# Altium project AHD Shield Template.PrjPcb
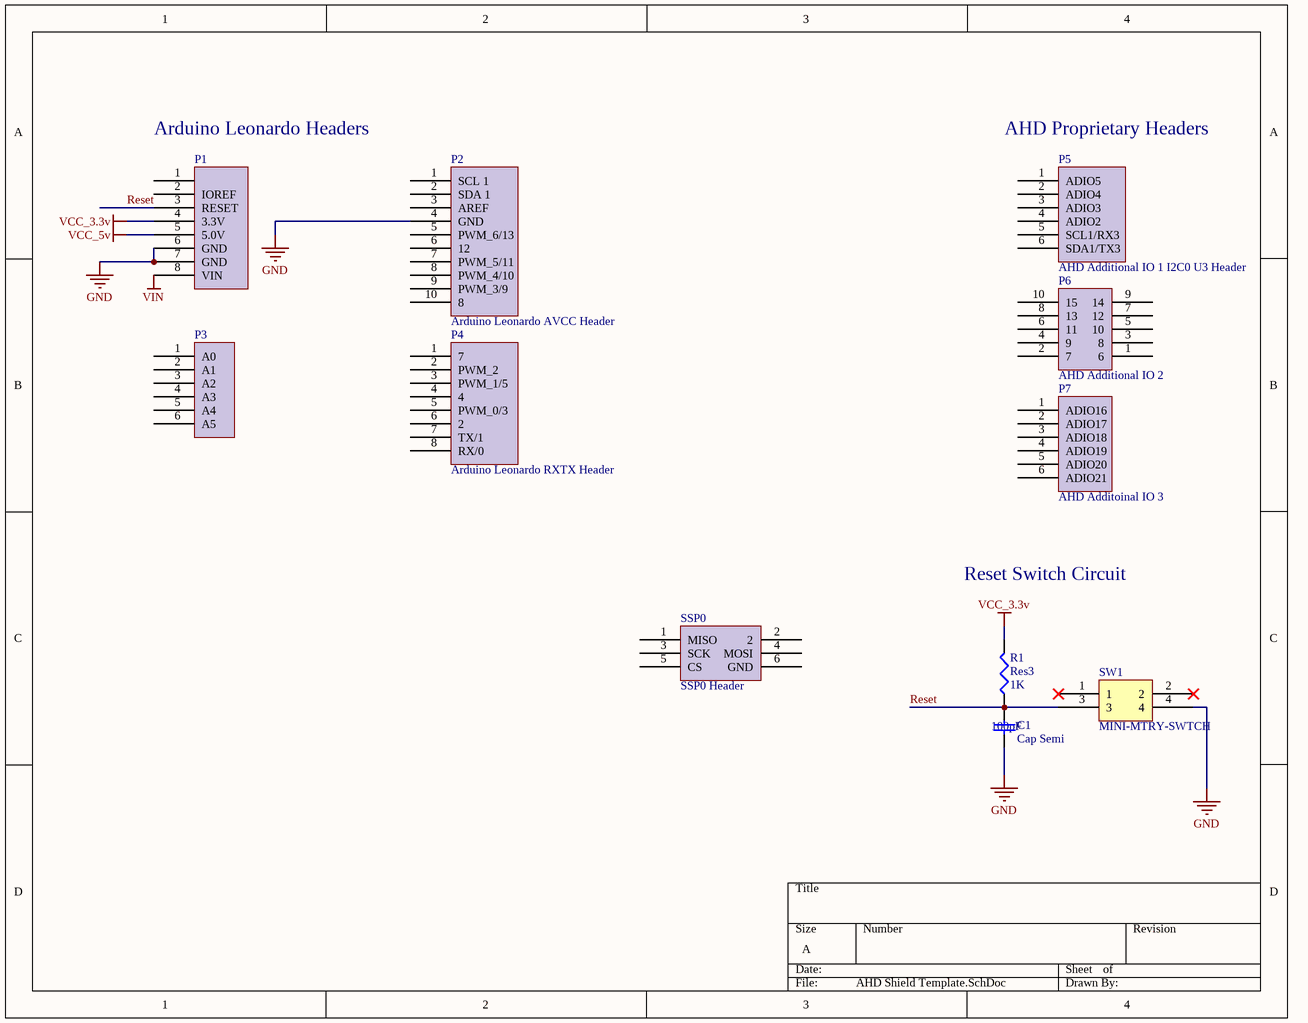
[diagram p0: AHD Shield Template.SchDoc]
1 sheet, 11 parts. Net scope: global (net labels, ports and power ports of the same name join across sheets).
Board file: AHD Shield Template.PcbDoc

## Sheet AHD Shield Template.SchDoc
size A

### Parts
C1  Cap Semi  value 100pF  [C1206]
P1  Arduino Leonardo Power Header  [Arduino Leonardo Power Header]  (value not drawn)
P2  Arduino Leonardo AVCC Header  [Arduino Leonardo AVCC Header]
P3  Arduino Leonardo Analog Header  [Arduino Leonardo Analog Header]  (value not drawn)
P4  Arduino Leonardo RXTX Header  [Arduino Leonardo RXTX PWM Header]
P5  AHD Additional IO 1 I2C0 U3 Header  [AHD Additional IO 1 I2C1 U3]
P6  AHD Additional IO 2  [AHD Additional IO 2 front Digital Header]
P7  AHD Additoinal IO 3  [AHD Additional IO 3 Header]
R1  Res3  value 1K  [J1-0603]
SSP0  SSP0 Header  [SSP0 Header]
SW1  MINI-MTRY-SWTCH  [Momentary Switch]

### Nets
GND: C1.1 P1.6(GND) P1.7(GND) P2.4(GND) SW1.4
VCC_3.3v: P1.4(3.3V) R1.2
VCC_5v: P1.5(5.0V)
VIN: P1.8(VIN)
Reset: C1.2 P1.3(RESET) R1.1 SW1.3

Not connected (* = marked no-connect by the designer): P1 1 2(IOREF); P2 1(SCL_1) 2(SDA_1) 3(AREF) 5(PWM_6/13) 6(12) 7(PWM_5/11) 8(PWM_4/10) 9(PWM_3/9) 10(8); P3 1(A0) 2(A1) 3(A2) 4(A3) 5(A4) 6(A5); P4 1(7) 2(PWM_2) 3(PWM_1/5) 4 5(PWM_0/3) 6(2) 7(TX/1) 8(RX/0); P5 1(ADIO5) 2(ADIO4) 3(ADIO3) 4(ADIO2) 5(SCL1/RX3) 6(SDA1/TX3); P6 1(6) 2(7) 3(8) 4(9) 5(10) 6(11) 7(12) 8(13) 9(14) 10(15); P7 1(ADIO16) 2(ADIO17) 3(ADIO18) 4(ADIO19) 5(ADIO20) 6(ADIO21); SSP0 1(MISO) 2 3(SCK) 4(MOSI) 5(CS) 6(GND); SW1 1* 2*

### Notes on the sheet
- (near P1) Arduino Leonardo Headers
- (near P5) AHD Proprietary Headers
- Reset Switch Circuit

### Library data of the parts
C1 = Cap Semi: Capacitor (Semiconductor SIM Model); Published: 8-Jun-2000; LatestRevisionDate: 29-May-2009; LatestRevisionNote: IPC-7351 Footprint Added.; PackageReference: C1206; Publisher: Altium Limited; PackageDescription: Chip Capacitor
P2 = Arduino Leonardo AVCC Header: Arduino Leonardo AREF Header
R1 = Res3: Resistor; Published: 8-Jun-2000; LatestRevisionDate: 29-May-2009; LatestRevisionNote: IPC-7351 Footprint Added.; PackageReference: J1-0603; Publisher: Altium Limited; PackageDescription: Chip Resistor
SW1 = Mini Momemtary Switch